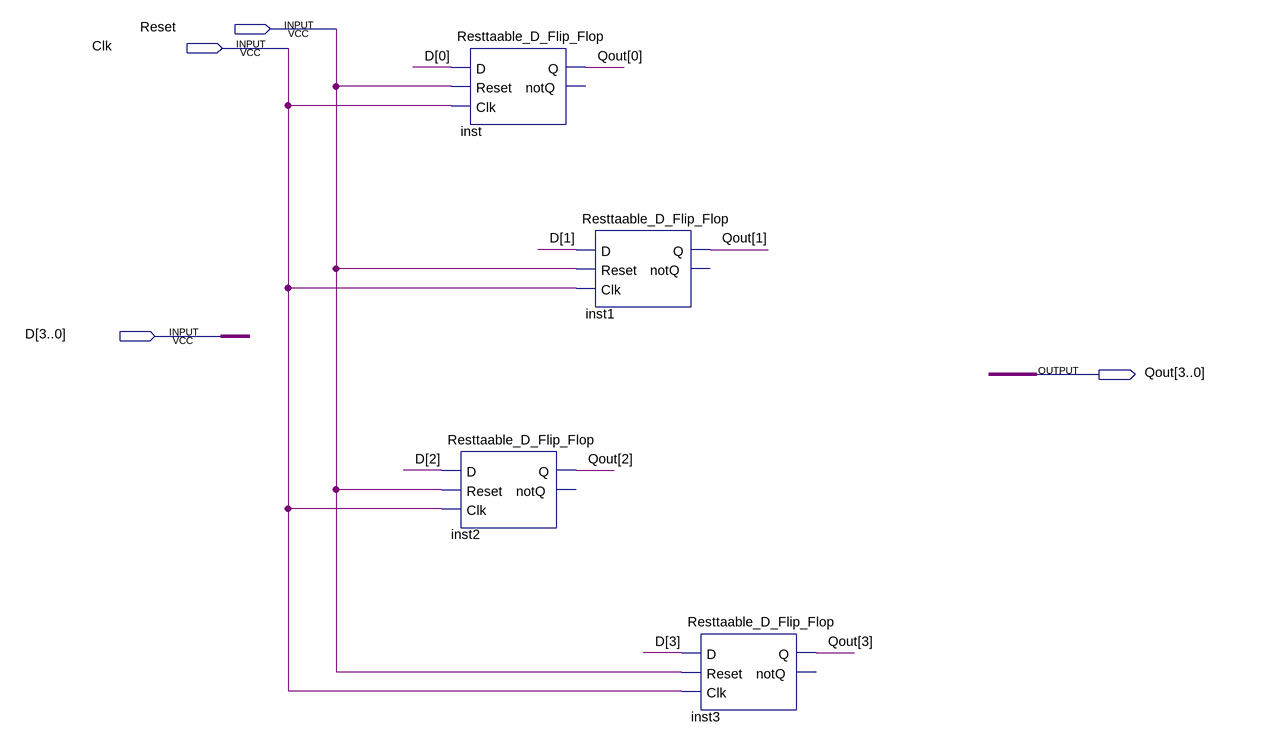
[diagram p0: schematic sheet]
// Quartus schematic FourBitRegister.bdf as structural Verilog: 4 symbols, 4 pins
module FourBitRegister (
  input  Reset,
  input  Clk,
  input  [3:0] D,
  output [3:0] Qout
);

  Resttaable_D_Flip_Flop inst (.D(D[0]), .Reset(Reset), .Clk(Clk), .Q(Qout[0]));  // open: notQ
  Resttaable_D_Flip_Flop inst2 (.D(D[2]), .Reset(Reset), .Clk(Clk), .Q(Qout[2]));  // open: notQ
  Resttaable_D_Flip_Flop inst1 (.D(D[1]), .Reset(Reset), .Clk(Clk), .Q(Qout[1]));  // open: notQ
  Resttaable_D_Flip_Flop inst3 (.D(D[3]), .Reset(Reset), .Clk(Clk), .Q(Qout[3]));  // open: notQ
endmodule
